# EAGLE design SD Card Board (EAGLE 8.6.1)
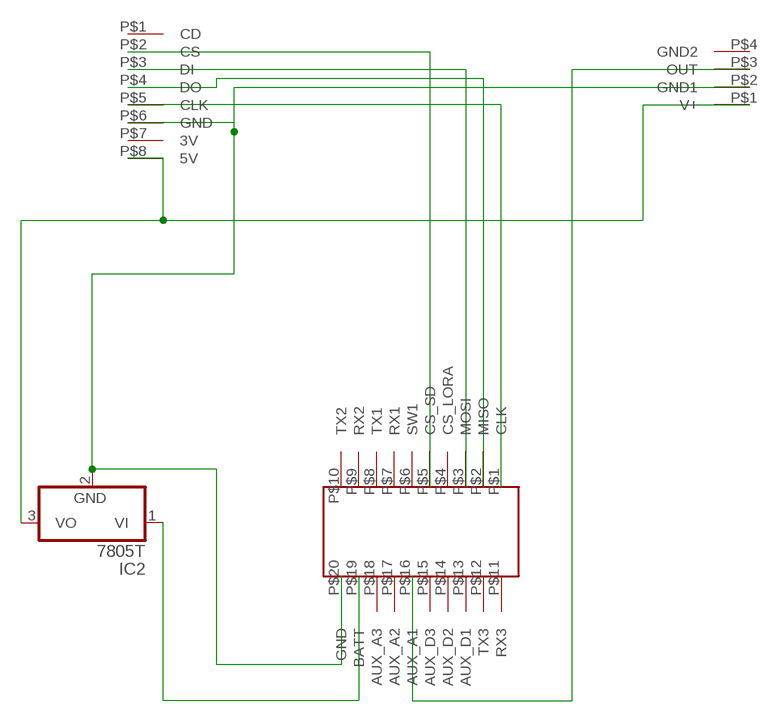
[diagram p0: schematic, sheet 1]

## Parts
IC2  7805T  [TO220H]
U$1  SMALLHEADERPACKAGE  [SMALLHEADERPACKAGE]
U$2  SDCARDREADER  [SDCARDBOARD]
U$3  THERMOCOUPLE  [THERMOBOARD]

## Nets
N$1: IC2.1(VI) U$1.P$19(BATT)
N$2: IC2.3(VO) U$2.P$8(5V) U$3.P$1(V+)
N$3: IC2.2(GND) U$1.P$20(GND) U$2.P$6(GND) U$3.P$2(GND1)
N$4: U$1.P$1(CLK) U$2.P$5(CLK)
N$5: U$1.P$16(AUX_A1) U$3.P$3(OUT)
N$6: U$1.P$2(MISO) U$2.P$4(DO)
N$7: U$1.P$3(MOSI) U$2.P$3(DI)
N$8: U$1.P$5(CS_SD) U$2.P$2(CS)
Unconnected: U$1.P$4(CS_LORA) U$1.P$6(SW1) U$1.P$7(RX1) U$1.P$8(TX1) U$1.P$9(RX2) U$1.P$10(TX2) U$1.P$11(RX3) U$1.P$12(TX3) U$1.P$13(AUX_D1) U$1.P$14(AUX_D2) U$1.P$15(AUX_D3) U$1.P$17(AUX_A2) U$1.P$18(AUX_A3) U$2.P$1(CD) U$2.P$7(3V) U$3.P$4(GND2)

## Library data of the parts
IC2 = linear3:78*: Positive VOLTAGE REGULATOR Source: http://cache.national.com/ds/LM/LM78L05.pdf http://www.fairchildsemi.com/ds/LM/LM7805.pdf
U$1 = LRA_FlightCPU_Connector:SMALLHEADERPACKAGE
U$2 = LRA_FlightCPU_Components:SDCARDREADER
U$3 = LRA_FlightCPU_Components:THERMOCOUPLE

## Board
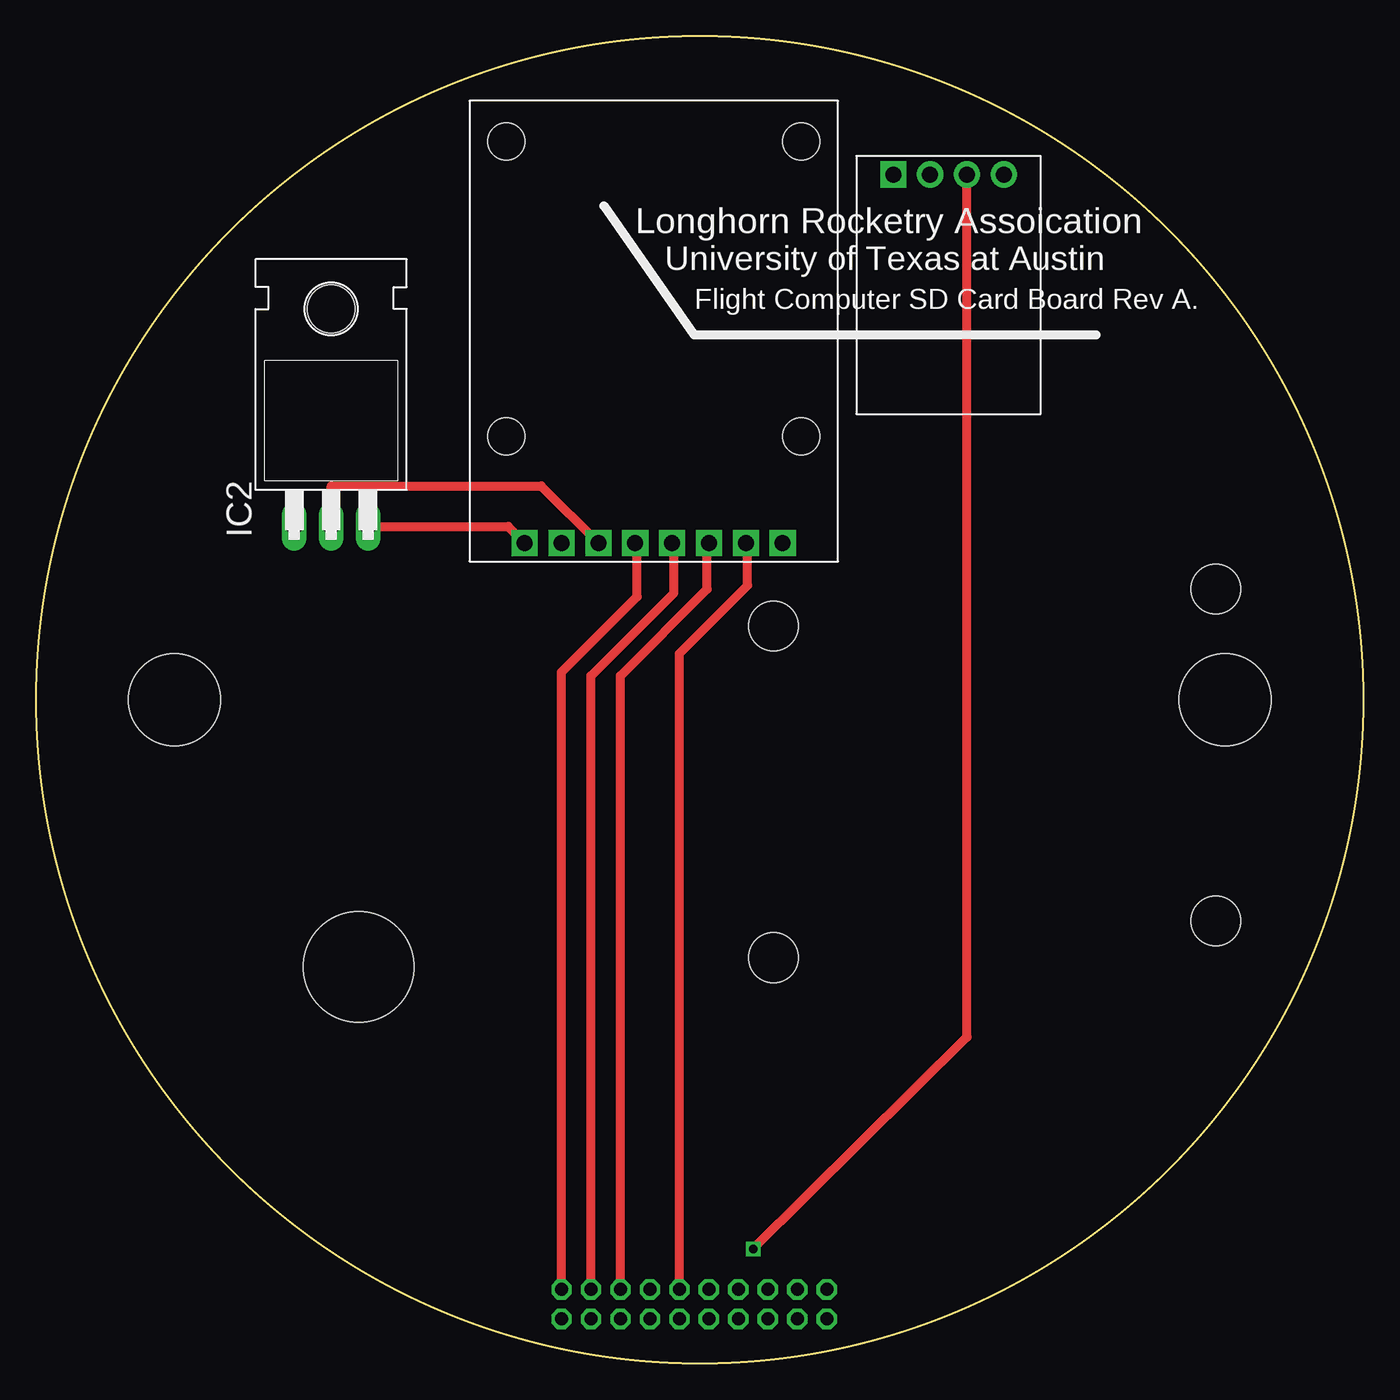
[diagram p1: board, top side]
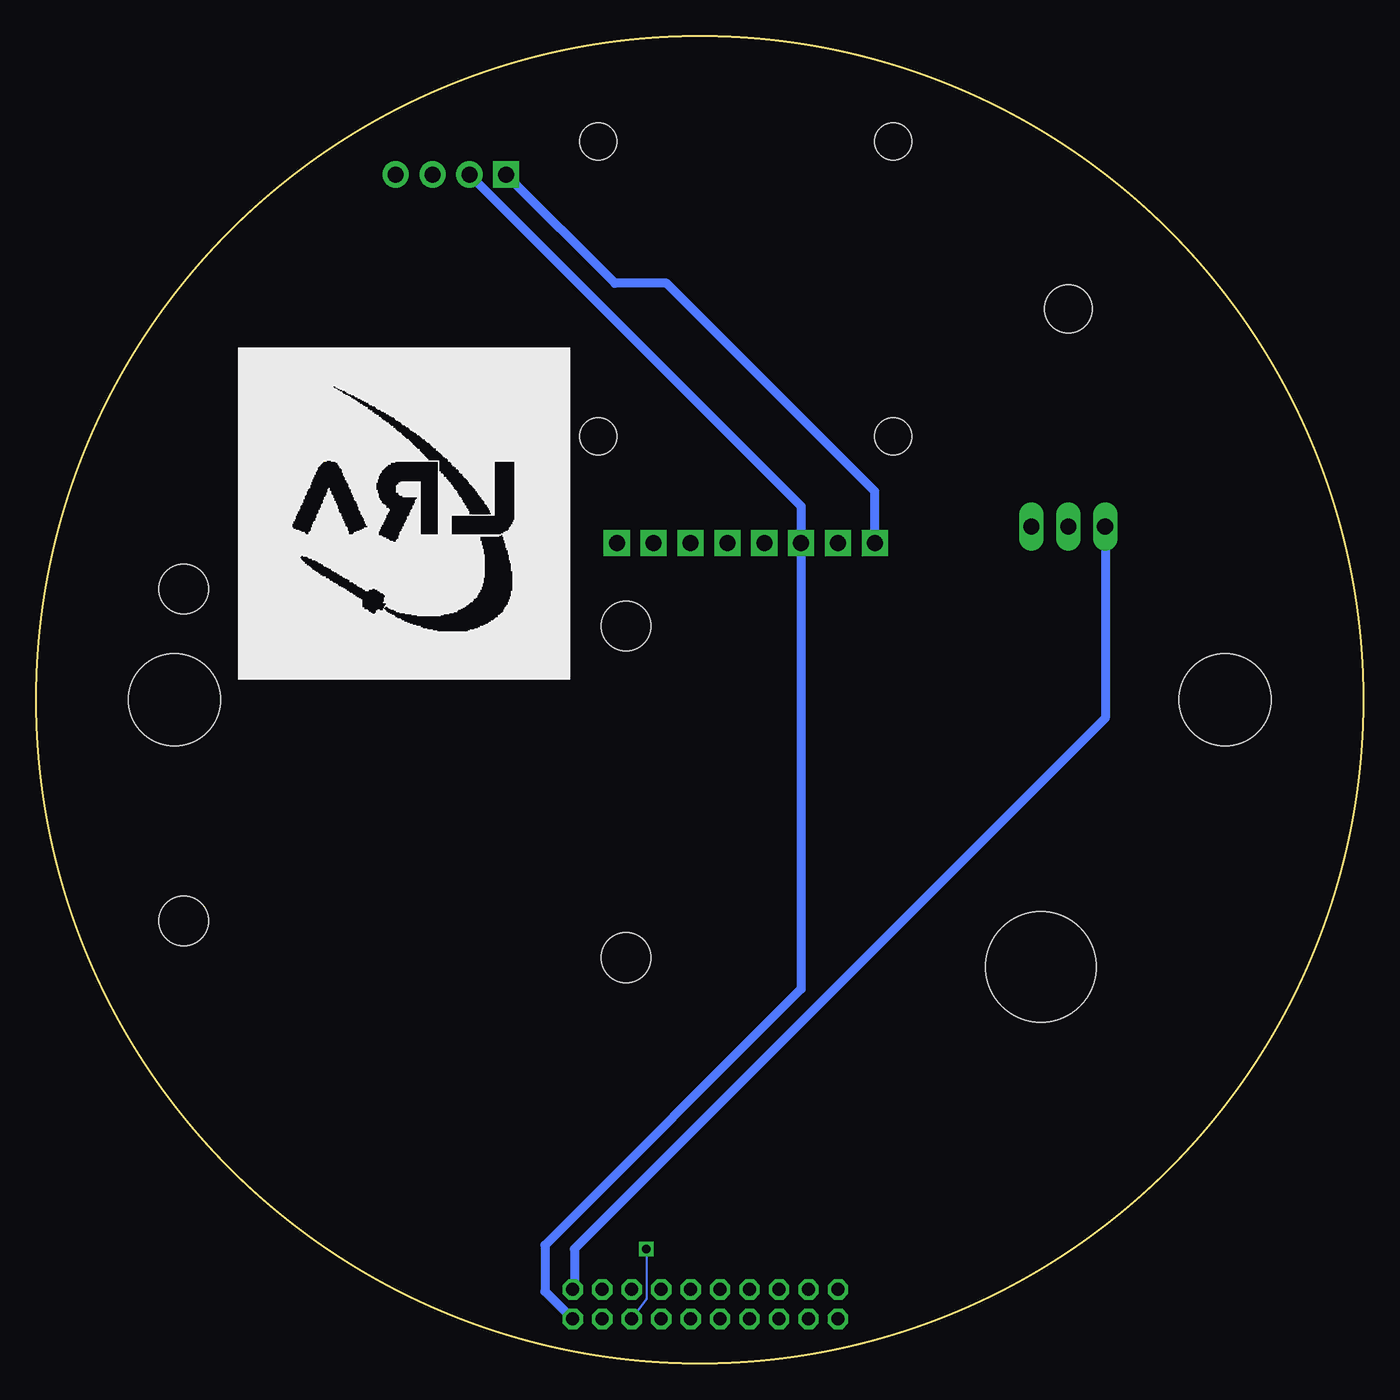
[diagram p2: board, bottom side, seen from below]

Size 91.44 x 91.44 mm. Coordinates in mm from the lower left corner, seen from the top.
Outline: circle at 45.72,45.72 radius 45.72
Copper layers (1*16): Top 0.035mm / dielectric 1.5mm / Bottom 0.035mm
Design rules "default *": minimum track width 0.3mm, minimum drill 0.35mm, track to track 10mil, track to pad 8mil, pad to pad 6mil, via to via 6mil, smd to smd 6mil, copper to edge 40mil, drill to drill 6mil, minimum pad ring 10mil, minimum via ring 8mil, stop-mask expansion 4mil, vias tented up to drill 0mil, thermal gap 10mil
Holes 6.35 mm at 9.53,45.72 81.92,45.72
Holes 7.62 mm at 22.23,27.3
Holes 3.43 mm at 81.28,53.34 50.8,50.8 81.28,30.48 50.8,27.94

### Footprints (pad centres in the part's own frame; a part is rotated, then mirrored left to right if it is on the bottom)
TO220H = drill 1.118 long: 1 -2.54,-10.16; 2 0,-10.16; 3 2.54,-10.16 | hole 3.302: 0,4.826
SMALLHEADERPACKAGE = drill 0.9 octagon: P$1 0,0; P$2 0,2.032; P$3 0,4.064; P$4 0,6.096; P$5 0,8.128; P$6 2.032,0; P$7 2.032,2.032; P$8 2.032,4.064; P$9 2.032,6.096; P$10 2.032,8.128; P$11 2.032,10.16; P$12 0,10.16; P$13 0,12.192; P$14 2.032,12.192; P$15 0,14.224; P$16 2.032,14.224; P$17 2.032,16.256; P$18 0,16.256; P$19 0,18.288; P$20 2.032,18.288
SDCARDBOARD = drill 1.1 pad 1.8 square: P$1 0,8.89; P$2 0,6.35; P$3 0,3.81; P$4 0,1.27; P$5 0,-1.27; P$6 0,-3.81; P$7 0,-6.35; P$8 0,-8.89 | hole 2.54: -27.686,10.16; -27.686,-10.16; -7.366,10.16; -7.366,-10.16
THERMOBOARD = drill 1.1 pad 1.8 square: P$1 0,3.81 | drill 1.1 pad 1.8: P$2 0,1.27; P$3 0,-1.27; P$4 0,-3.81

### Placement (x,y rotation side)
IC2  20.32,67.82 0 top
U$1  36.2,5.08 270 top
U$2  42.55,56.52 270 top
U$3  62.87,81.92 90 top

### Tracks (layer width: path | path; a pad name or v marks a point on that pad's centre or on a via)
N$1
  Bottom 0.61: IC2.1 17.78,44.45 54.36,7.87 54.36,5.21 U$1.P$19
N$2
  Top 0.61: IC2.3 32.51,57.66 U$2.P$8
  Bottom 0.61: U$2.P$8 33.66,60.07 48.01,74.42 51.56,74.42 U$3.P$1
N$3
  Top 0.61: IC2.2 20.32,60.45 34.8,60.45 U$2.P$6
  Bottom 0.61: U$3.P$2 38.73,59.05 U$2.P$6 38.73,25.78 56.39,8.13 56.39,4.95 U$1.P$20
N$4
  Top 0.61: U$1.P$1 36.2,47.62 41.4,52.83 41.4,56.39 U$2.P$5
N$5  (via drill 0.6)
  Top 0.61: U$3.P$3 64.14,22.48 v49.4,7.87
  Bottom 0.127: v49.4,7.87 49.4,4.45 U$1.P$16
N$6
  Top 0.61: U$1.P$2 38.23,47.37 43.94,53.09 43.94,56.39 U$2.P$4
N$7
  Top 0.61: U$1.P$3 40.26,47.37 46.23,53.34 46.23,56.39 U$2.P$3
N$8
  Top 0.61: U$1.P$5 44.32,48.9 49.02,53.59 49.02,56.39 U$2.P$2

### Text on the board
tPlace: Longhorn Rocketry Assoication | University of Texas at Austin | Flight Computer SD Card Board Rev A.